# Altium schematic sheet mecanum_car_controller.SchDoc
size A3; SheetNumber: 1; SheetTotal: 1
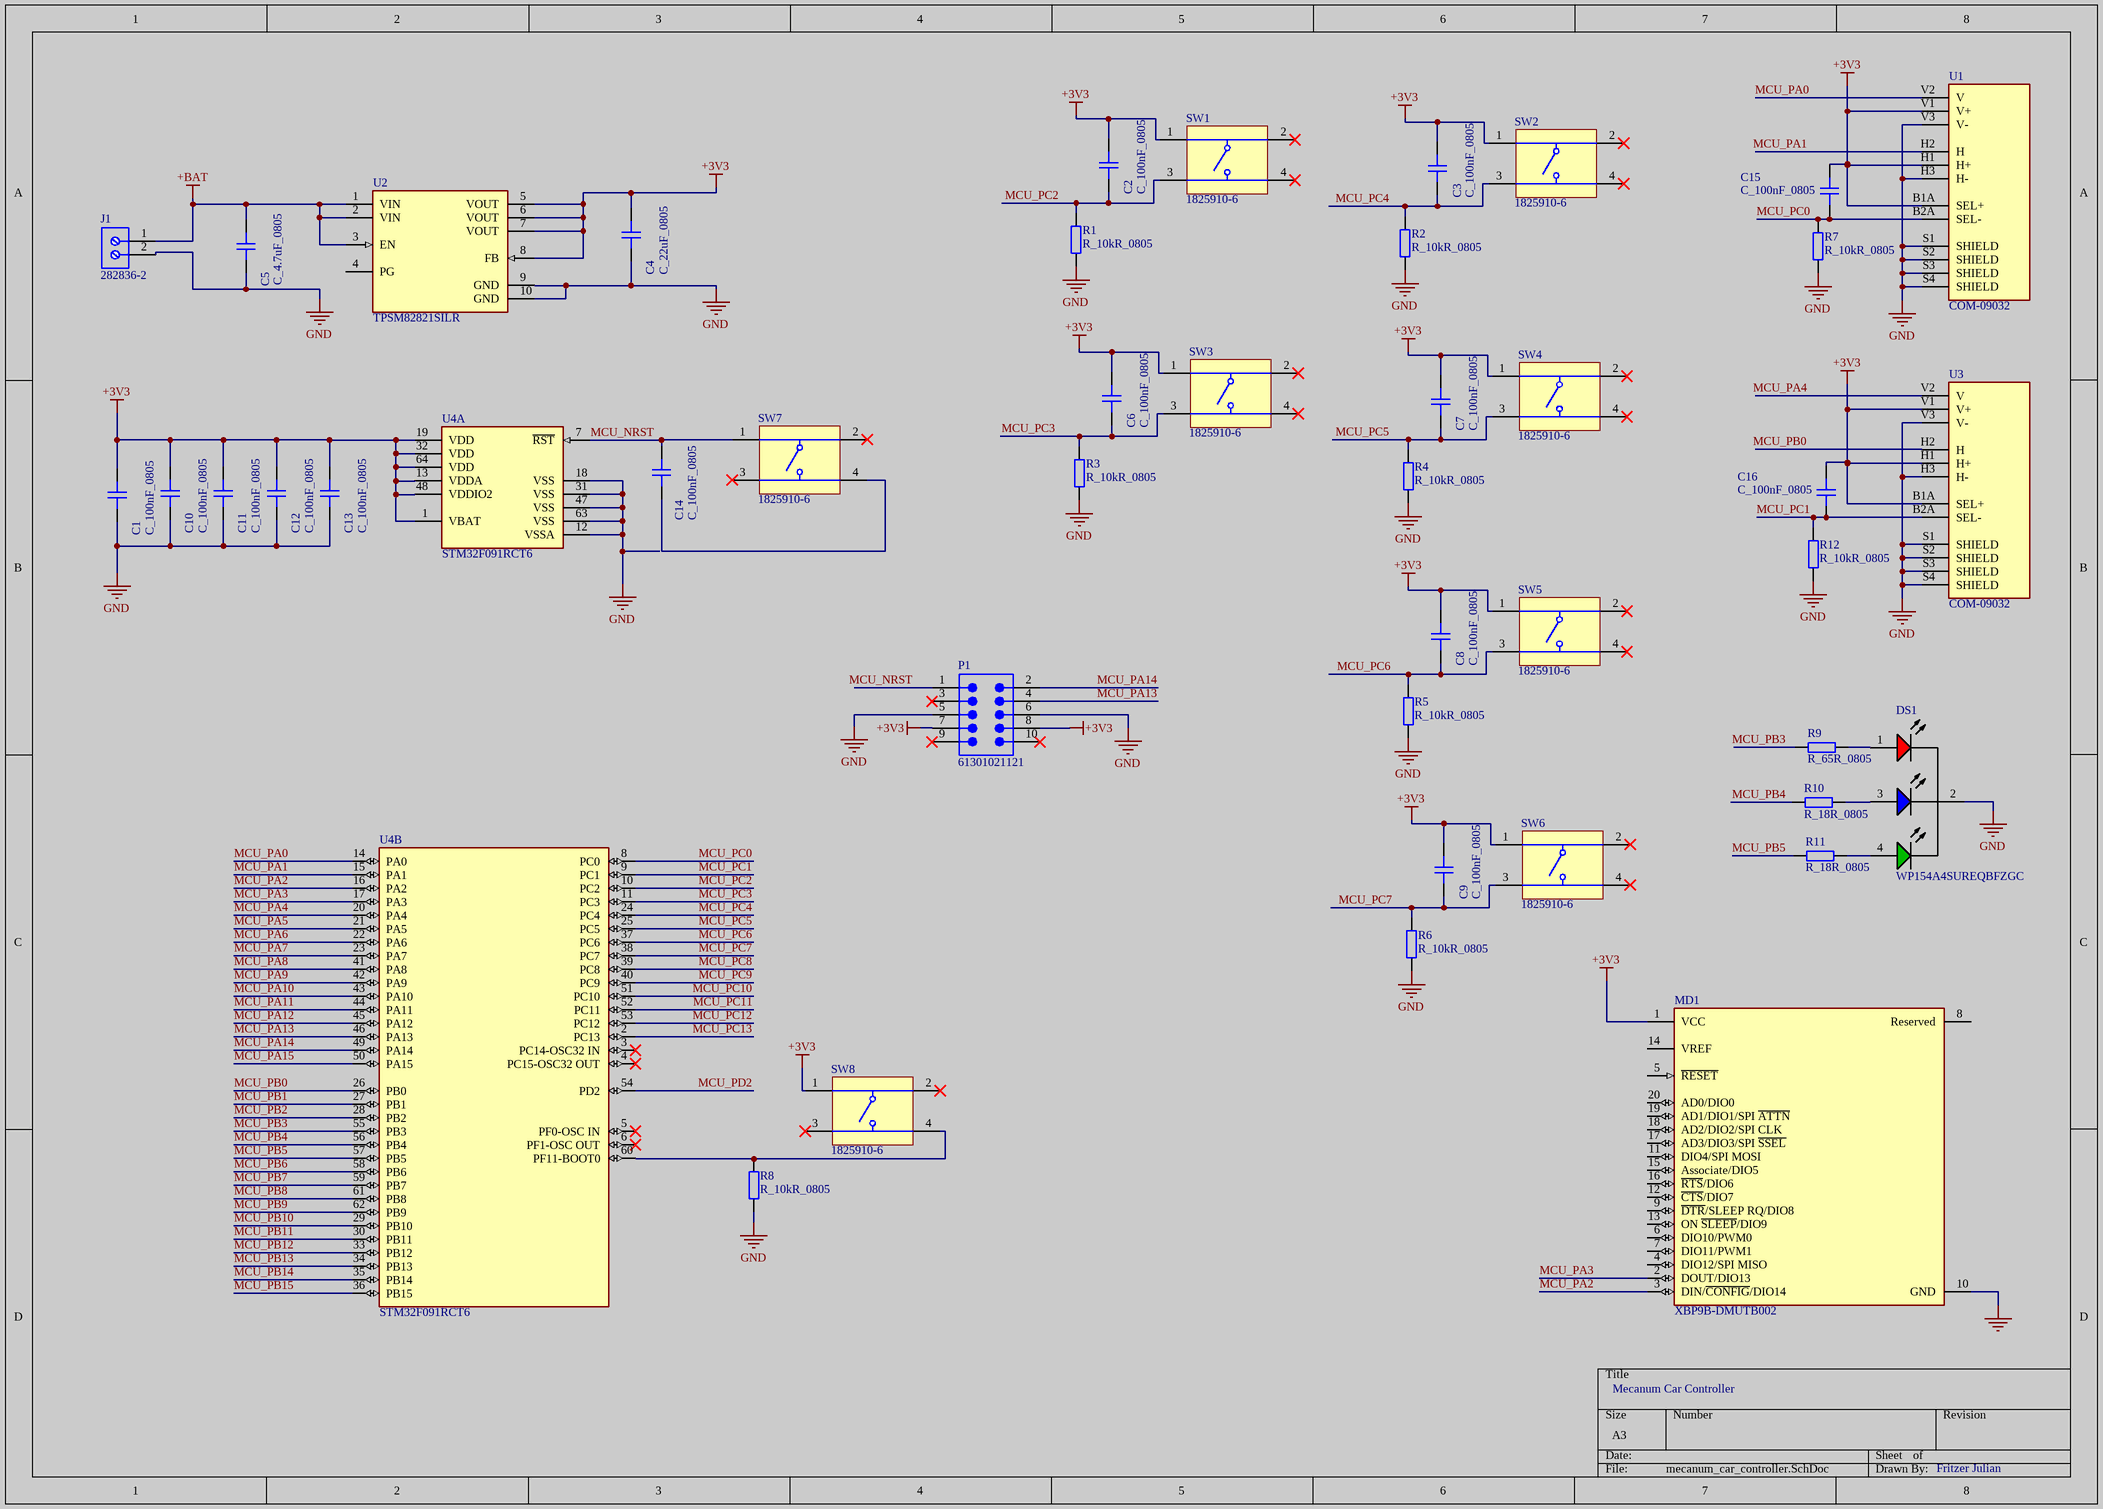
[diagram p0: mecanum_car_controller.SchDoc]

## Parts
C1  C_100nF_0805  [CAP_0805]
C2  C_100nF_0805  [CAP_0805]
C3  C_100nF_0805  [CAP_0805]
C4  C_22uF_0805  [CAP_0805]
C5  C_4.7uF_0805  [CAP_0805]
C6  C_100nF_0805  [CAP_0805]
C7  C_100nF_0805  [CAP_0805]
C8  C_100nF_0805  [CAP_0805]
C9  C_100nF_0805  [CAP_0805]
C10  C_100nF_0805  [CAP_0805]
C11  C_100nF_0805  [CAP_0805]
C12  C_100nF_0805  [CAP_0805]
C13  C_100nF_0805  [CAP_0805]
C14  C_100nF_0805  [CAP_0805]
C15  C_100nF_0805  [CAP_0805]
C16  C_100nF_0805  [CAP_0805]
DS1  WP154A4SUREQBFZGC  [KING-WP154A4SUREQBFZGC_V]
J1  282836-2  [TECO-282836-2_V]
MD1  XBP9B-DMUTB002  [FP-XBP9B-DMUTB002-MFG]
P1  61301021121  [61301021121]
R1  R_10kR_0805  [RES_0805]
R2  R_10kR_0805  [RES_0805]
R3  R_10kR_0805  [RES_0805]
R4  R_10kR_0805  [RES_0805]
R5  R_10kR_0805  [RES_0805]
R6  R_10kR_0805  [RES_0805]
R7  R_10kR_0805  [RES_0805]
R8  R_10kR_0805  [RES_0805]
R9  R_65R_0805  [RES_0805]
R10  R_18R_0805  [RES_0805]
R11  R_18R_0805  [RES_0805]
R12  R_10kR_0805  [RES_0805]
SW1  1825910-6  [TECO-1825910-6_V]
SW2  1825910-6  [TECO-1825910-6_V]
SW3  1825910-6  [TECO-1825910-6_V]
SW4  1825910-6  [TECO-1825910-6_V]
SW5  1825910-6  [TECO-1825910-6_V]
SW6  1825910-6  [TECO-1825910-6_V]
SW7  1825910-6  [TECO-1825910-6_V]
SW8  1825910-6  [TECO-1825910-6_V]
U1  COM-09032  [XDCR_COM-09032]
U2  TPSM82821SILR  [FP-SIL0010D-MFG]
U3  COM-09032  [XDCR_COM-09032]
U4  STM32F091RCT6  [FP-LQFP64-5W-MFG]  (parts A,B of 2)

## Nets
+3V3: C1.2 C2.2 C3.2 C4.2 C6.2 C7.2 C8.2 C9.2 C10.2 C11.2 C12.2 C13.2 C15.2 C16.2 MD1.1(VCC) P1.7 P1.8 SW1.1 SW2.1 SW3.1 SW4.1 SW5.1 SW6.1 SW8.1 U1.B1A(SEL+) U1.H1(H+) U1.V1(V+) U2.5(VOUT) U2.6(VOUT) U2.7(VOUT) U2.8(FB) U3.B1A(SEL+) U3.H1(H+) U3.V1(V+) U4.1(VBAT) U4.13(VDDA) U4.19(VDD) U4.32(VDD) U4.48(VDDIO2) U4.64(VDD)
+BAT: C5.2 J1.1 U2.1(VIN) U2.2(VIN) U2.3(EN)
GND: C1.1 C4.1 C5.1 C10.1 C11.1 C12.1 C13.1 DS1.2(CATHODE) J1.2 P1.5 P1.6 R1.2 R2.2 R3.2 R4.2 R5.2 R6.2 R7.2 R8.2 R12.2 U1.H3(H-) U1.S1(SHIELD) U1.S2(SHIELD) U1.S3(SHIELD) U1.S4(SHIELD) U1.V3(V-) U2.9(GND) U2.10(GND) U3.H3(H-) U3.S1(SHIELD) U3.S2(SHIELD) U3.S3(SHIELD) U3.S4(SHIELD) U3.V3(V-) U4.12(VSSA) U4.18(VSS) U4.31(VSS) U4.47(VSS) U4.63(VSS)
MCU_NRST: C14.2 P1.1 SW7.1 U4.7(~{RST})
MCU_PA0: U1.V2(V) U4.14(PA0)
MCU_PA1: U1.H2(H) U4.15(PA1)
MCU_PA2: MD1.3(DIN/~{CONFIG}/DIO14) U4.16(PA2)
MCU_PA3: MD1.2(DOUT/DIO13) U4.17(PA3)
MCU_PA4: U3.V2(V) U4.20(PA4)
MCU_PA5: U4.21(PA5)
MCU_PA6: U4.22(PA6)
MCU_PA7: U4.23(PA7)
MCU_PA8: U4.41(PA8)
MCU_PA9: U4.42(PA9)
MCU_PA10: U4.43(PA10)
MCU_PA11: U4.44(PA11)
MCU_PA12: U4.45(PA12)
MCU_PA13: P1.4 U4.46(PA13)
MCU_PA14: P1.2 U4.49(PA14)
MCU_PA15: U4.50(PA15)
MCU_PB0: U3.H2(H) U4.26(PB0)
MCU_PB1: U4.27(PB1)
MCU_PB2: U4.28(PB2)
MCU_PB3: R9.2 U4.55(PB3)
MCU_PB4: R10.2 U4.56(PB4)
MCU_PB5: R11.2 U4.57(PB5)
MCU_PB6: U4.58(PB6)
MCU_PB7: U4.59(PB7)
MCU_PB8: U4.61(PB8)
MCU_PB9: U4.62(PB9)
MCU_PB10: U4.29(PB10)
MCU_PB11: U4.30(PB11)
MCU_PB12: U4.33(PB12)
MCU_PB13: U4.34(PB13)
MCU_PB14: U4.35(PB14)
MCU_PB15: U4.36(PB15)
MCU_PC0: C15.1 R7.1 U1.B2A(SEL-) U4.8(PC0)
MCU_PC1: C16.1 R12.1 U3.B2A(SEL-) U4.9(PC1)
MCU_PC2: C2.1 R1.1 SW1.3 U4.10(PC2)
MCU_PC3: C6.1 R3.1 SW3.3 U4.11(PC3)
MCU_PC4: C3.1 R2.1 SW2.3 U4.24(PC4)
MCU_PC5: C7.1 R4.1 SW4.3 U4.25(PC5)
MCU_PC6: C8.1 R5.1 SW5.3 U4.37(PC6)
MCU_PC7: C9.1 R6.1 SW6.3 U4.38(PC7)
MCU_PC8: U4.39(PC8)
MCU_PC9: U4.40(PC9)
MCU_PC10: U4.51(PC10)
MCU_PC11: U4.52(PC11)
MCU_PC12: U4.53(PC12)
MCU_PC13: U4.2(PC13)
MCU_PD2: U4.54(PD2)
NetC14_1: C14.1 SW7.4
NetDS1_1: DS1.1(RED) R9.1
NetDS1_3: DS1.3(BLUE) R10.1
NetDS1_4: DS1.4(GREEN) R11.1
NetR8_1: R8.1 SW8.4 U4.60(PF11-BOOT0)

Not connected (* = marked no-connect by the designer): MD1 4(DIO12/SPI_MISO) 5(~{RESET}) 6(DIO10/PWM0) 7(DIO11/PWM1) 8(Reserved) 9(~{DTR}/SLEEP_RQ/DIO8) 10(GND) 11(DIO4/SPI_MOSI) 12(~{CTS}/DIO7) 13(ON_~{SLEEP}/DIO9) 14(VREF) 15(Associate/DIO5) 16(~{RTS}/DIO6) 17(AD3/DIO3/SPI_~{SSEL}) 18(AD2/DIO2/SPI_CLK) 19(AD1/DIO1/SPI_~{ATTN}) 20(AD0/DIO0); P1 3* 9* 10*; SW1 2* 4*; SW2 2* 4*; SW3 2* 4*; SW4 2* 4*; SW5 2* 4*; SW6 2* 4*; SW7 2* 3*; SW8 2* 3*; U2 4(PG); U4 3(PC14-OSC32_IN)* 4(PC15-OSC32_OUT)* 5(PF0-OSC_IN)* 6(PF1-OSC_OUT)*

## Notes on the sheet
- Mecanum Car Controller
- Fritzer Julian

## Library data of the parts
C1-C16 = CAP_0805: Capacitor SMD 0805; Manufacturer: *; Manufacturer Part Number: *; Distributor Link: *; LCSC: *; Rating: *; Dielectric: *
DS1 = CMP-2000-07415-1: Full Color LED Lamp, Dominant Wavelength RGB 630 / 525 / 465 nm, -40 to 85 degC, 4-Pin THD, RoHS; Manufacturer: Kingbright; Viewing Angle: 50°; Wavelength - Dominant: 630nm,525nm,465nm; Online Catalog: 5mm,T-13/4(RGB)RoundwithDomedTopLEDLamp; Millicandela Rating: 1300mcdRed,1700mcdGreen,900mcdBlue; Other Names: 754-1615 / WP154A4SUREQBFZGC-ND; Current - Test: 20mA; Wavelength - Peak: 645nm,515nm,460nm; Color: Red,Green,Blue(RGB); Voltage - Forward (Vf) (Typ): 1.9VRed,3.3VGreen,3.3VBlue; Lens Type: Clear; 3D Model: WP154A4SUREQBFZGW.sldprt / WP154A4SUREQBFZGW.pro / WP154A4SUREQBFZGW.igs / WP154A4SUREQBFZGW.stp; Lens Style/Size: RoundwithDomedTop,5mm,T-13/4; Packaging: Bulk; Datasheet URL: https://www.kingbrightusa.com/images/catalog/spec/WP154A4SUREQBFZGC.pdf; Family: LEDIndication-Discrete; Datasheet Version: Rev. 5A, 08/2014; Category: Optoelectronics; Manufacturer URL: http://www.kingbright.com/; Height: 8.60mm; Mounting Type: ThroughHole; Package Reference: WP154A4SUREQBFZGC; Mounting Technology: ThroughHole; Package Description: 4-Pin Through Hole LED, Dia 5.9 mm, Pitch 1.27 mm; Standard Package: 500; Package / Case: Radial-4Leads
J1 = CMP-1684-00017-1: Female Header, Pitch 5 mm, 1 x 2 Position, Height 10 mm, Tail Length 3.5 mm, Rohs, Bulk; Manufacturer: TE Connectivity; Wire Gauge: 16-30AWG; Product Training Modules: Wire-to-BoardEurostyleTerminalBlocks; Clamp Material - Plating: Brass-NickelPlated; Voltage: 300V; Mating Orientation: HorizontalwithBoard; Current: 13.5A; Pitch: 0.197"(5.00mm); Screw Thread: M3; 3D Model: 282836-2.pdf; Other Names: 5ULV-02B / A98076; Dynamic Catalog: BuchananSeries; Number of Levels: 1; Torque - Screw: 0.68Nm(6Lb-In); Featured Product: EurostyleTerminalBlockConnectors; Positions Per Level: 2; Wire Termination: Screw-RisingCageClamp; Datasheet URL: http://www.te.com.cn/commerce/DocumentDelivery/DDEController?Action=showdoc&DocId=Catalog+Section%7F1308389_EUROSTYLE_TERMINAL_BLOCKS%7F0607%7Fpdf%7FEnglish%7FENG_CS_1308389_EUROSTYLE_TERMINAL_BLOCKS_0607.pdf%7F282836-2; Color: Green; Family: TerminalBlocks-WiretoBoard; RoHS Information: 282836-2StatementofCompliance; Standard Package: 300; Contact Material - Plating: Brass-TinPlated; Manufacturer URL: http://www.te.com; Housing Material: Polyamide(PA66),Nylon6/6; Features: Interlocking(Side); Package Description: Female Header, Pitch 5 mm, 1 x 2 Position, Height 10 mm, Tail Length 3.5 mm; Mounting Type: ThroughHole; Package Reference: THD; Packaging: Bulk; Series: Buchanan; Category: Connectors,Interconnects; Screw Material - Plating: Brass-NickelPlated
MD1 = CMP-84319-000004-1: RX TXRX MOD ISM < 1GHZ U.FL TH; Max Supply Voltage: 3.6V; Current - Transmitting: 215mA; Sensitivity: -101dBm; Min Frequency: 902MHz; Memory Size: 2KB; Max Frequency: 928MHz; Min Supply Voltage: 2.4V; Current - Receiving: 29mA; Interface: SPI; Data Rate: 200Kbps; Frequency: 900MHz; Output Power (dBm): 24dBm; Number of Pins: 20; Series: XBee-Pro™; Max Operating Temperature: 85°C; Radiation Hardening: No; Min Operating Temperature: -40°C; Package Quantity: 1; RAM Size: 2KB; Packaging: Bulk; Case/Package: Module
P1 = CMP-1502-01084-3: NexarPartId: 18818163; Connector Type: Male Pin; Insulation Resistance: 1GΩ; Row Spacing: 2.54mm; Insulation: Insulated; Number of Positions: 10; Current Rating: 3A; Voltage Rating: 250V; Gender: Male; Contact Resistance: 20mΩ; Contact Gender: Male; Number of Rows: 2; Min Operating Temperature: -40°C; Mount: Through Hole; Packaging: Bulk; Length: 12.7mm; Pitch: 2.54mm; RoHS: Compliant; Height: 2.54mm; Lead Pitch: 2.54mm; Number of Pins: 10; Housing Material: PBT; Orientation: Vertical; Flammability Rating: UL94 V-0; Termination: Through Hole; Width: 12.7mm; Color: Black; Contact Mating Length: 5.9944mm; Max Operating Temperature: 105°C; Operating Supply Voltage: 250V; Contact Material: Copper; Number of Contacts: 10; Contact Plating: Gold; REACH SVHC: Unknown
R1-R12 = RES_0805: Resistor SMD 0805; Manufacturer: *; Manufacturer Part Number: *; Distributor Link: *; LCSC: *
SW1-SW8 = CMP-1684-00021-1: Tact Switch, SPST-NO, 0.05 A, -35 to 85 degC, 4-Pin THD, RoHS, Bulk; Manufacturer: TE Connectivity; Maximum Contact Resistance: 100mOhm; Mechanical Life: 100000Cycles; Bushing Type: Unthreaded; Switch Configuration: OFF(ON); Maximum DC Voltage Rating: 24V; Contact Rating @ Voltage: 0.05A@24VDC; Actuator Color: Black; Body Orientation: Straight; Function: MomentaryContact; Illumination: N/R; Actuator Style: RoundButton; Actuator Material: PolybutyleneTerephthalate; Dielectric Strength: 500VAC; Pole Throw Configuration: SPST; Actuator Length: 1.4mm; Product Weight: N/A; Contact Material: CopperAlloy; Housing Material: N/A; Terminal Type: PCPins; Minimum Insulation Resistance: 100MOhm; Package Description: 4-Pin Through Hole Device, Body 5.99 x 5.99 mm, Pitch 6.5 mm; Part No: 1825910-6; Package Reference: THD; Base Material: N/A; Manufacturer URL: http://www.te.com; Contact Plating: Silver; RoHS: Yes; Datasheet Version: Rev. C9; Electrical Life: 100000Cycles; Maximum AC Voltage Rating: N/A; Thread Size: N/R; Operating Temperature: -35to85C; Mounting: ThroughHole; Dimension: 5.99x5mm; Datasheet URL: http://www.te.com/commerce/DocumentDelivery/DDEController?Action=showdoc&DocId=Customer+Drawing%7F1825910%7FC9%7Fpdf%7FEnglish%7FENG_CD_1825910_C9.pdf%7F1825910-6; Family: 1825910; Seal Location: N/A; Seal Description: N/A; Packaging: N/A
U1 U3 = CMP-032-000000-1: Thumb Joystick; Price: None; MP: COM-09032; Availability: Unavailable; Value: *; Source: COM-09032.SchLib; Pin Count: 12; Package: None; Design Item ID: COM-09032; Component Type: Standard
U2 = CMP-04918-000191-1: 5.5-V INPUT, 1-A STEP-DOWN MODUL; RoHS Compliant: Yes
U4 = CMP-0304-00199-4: IC MCU 32BIT 256KB FLASH 64LQFP; Manufacturer: STMicroelectronics; Ram Size: 32KBytes; Number Of Pwm Channels: 6; Interface: I2C,SPI,USART,CAN,LIN,IrDA,I2S,SMBus; Memory Size: 256KBytes; Number Of Cores: 1; Max Supply Voltage: 3.6V; Core Architecture: ARM Cortex-M0; Number Of Timers/Counters: 10; Data Bus Width: 32bits; Number Of I2C Channels: 2; Frequency: 48MHz; Max Junction Temp: +105°C; Number Of Adc Channels: 19; Number Of Uart Channels: 8; Standoff Height: 0.05mm; Number Of I/Os: 52; Nominal Supply Current: 0.9-26.9mA; Min Supply Voltage: 2V; Package: LQFP64-5W; Device Class L2: Embedded Processors and Controllers; Memory Type: FLASH; Category: IC; Temperature Range Low: -40°C; Temperature: -40°C to +85°C; Temperature Range High: +85°C; RoHS: TRUE; Lead Free: Yes; Number Of A/D Converters: 1; ComponentLink2Description: Datasheet; Mouser Description: ARM Microcontrollers - MCU 16/32-BITS MICROS; Height: 1.6mm; Ambient Temperature Range High: +85°C; Device Class L3: Microcontrollers; ComponentLink2URL: https://www.st.com/resource/en/datasheet/stm32f091rc.pdf; Number Of Spi Channels: 2; Device Class L1: Integrated Circuits (ICs); Octopart: https://octopart.com/stm32f091rct6-stmicroelectronics-51988683; Ambient Temperature Range Low: -40°C; Digikey Description: IC MCU 32BIT 256KB FLASH 64LQFP; Ipc Land Pattern Name: QFP50P1200X1200X160-64; Manufacturer Part Number: STM32F091RCT6; Automotive: No